# EAGLE design MySens-GWeasySensRS485-V01-045 (EAGLE 7.6.0)
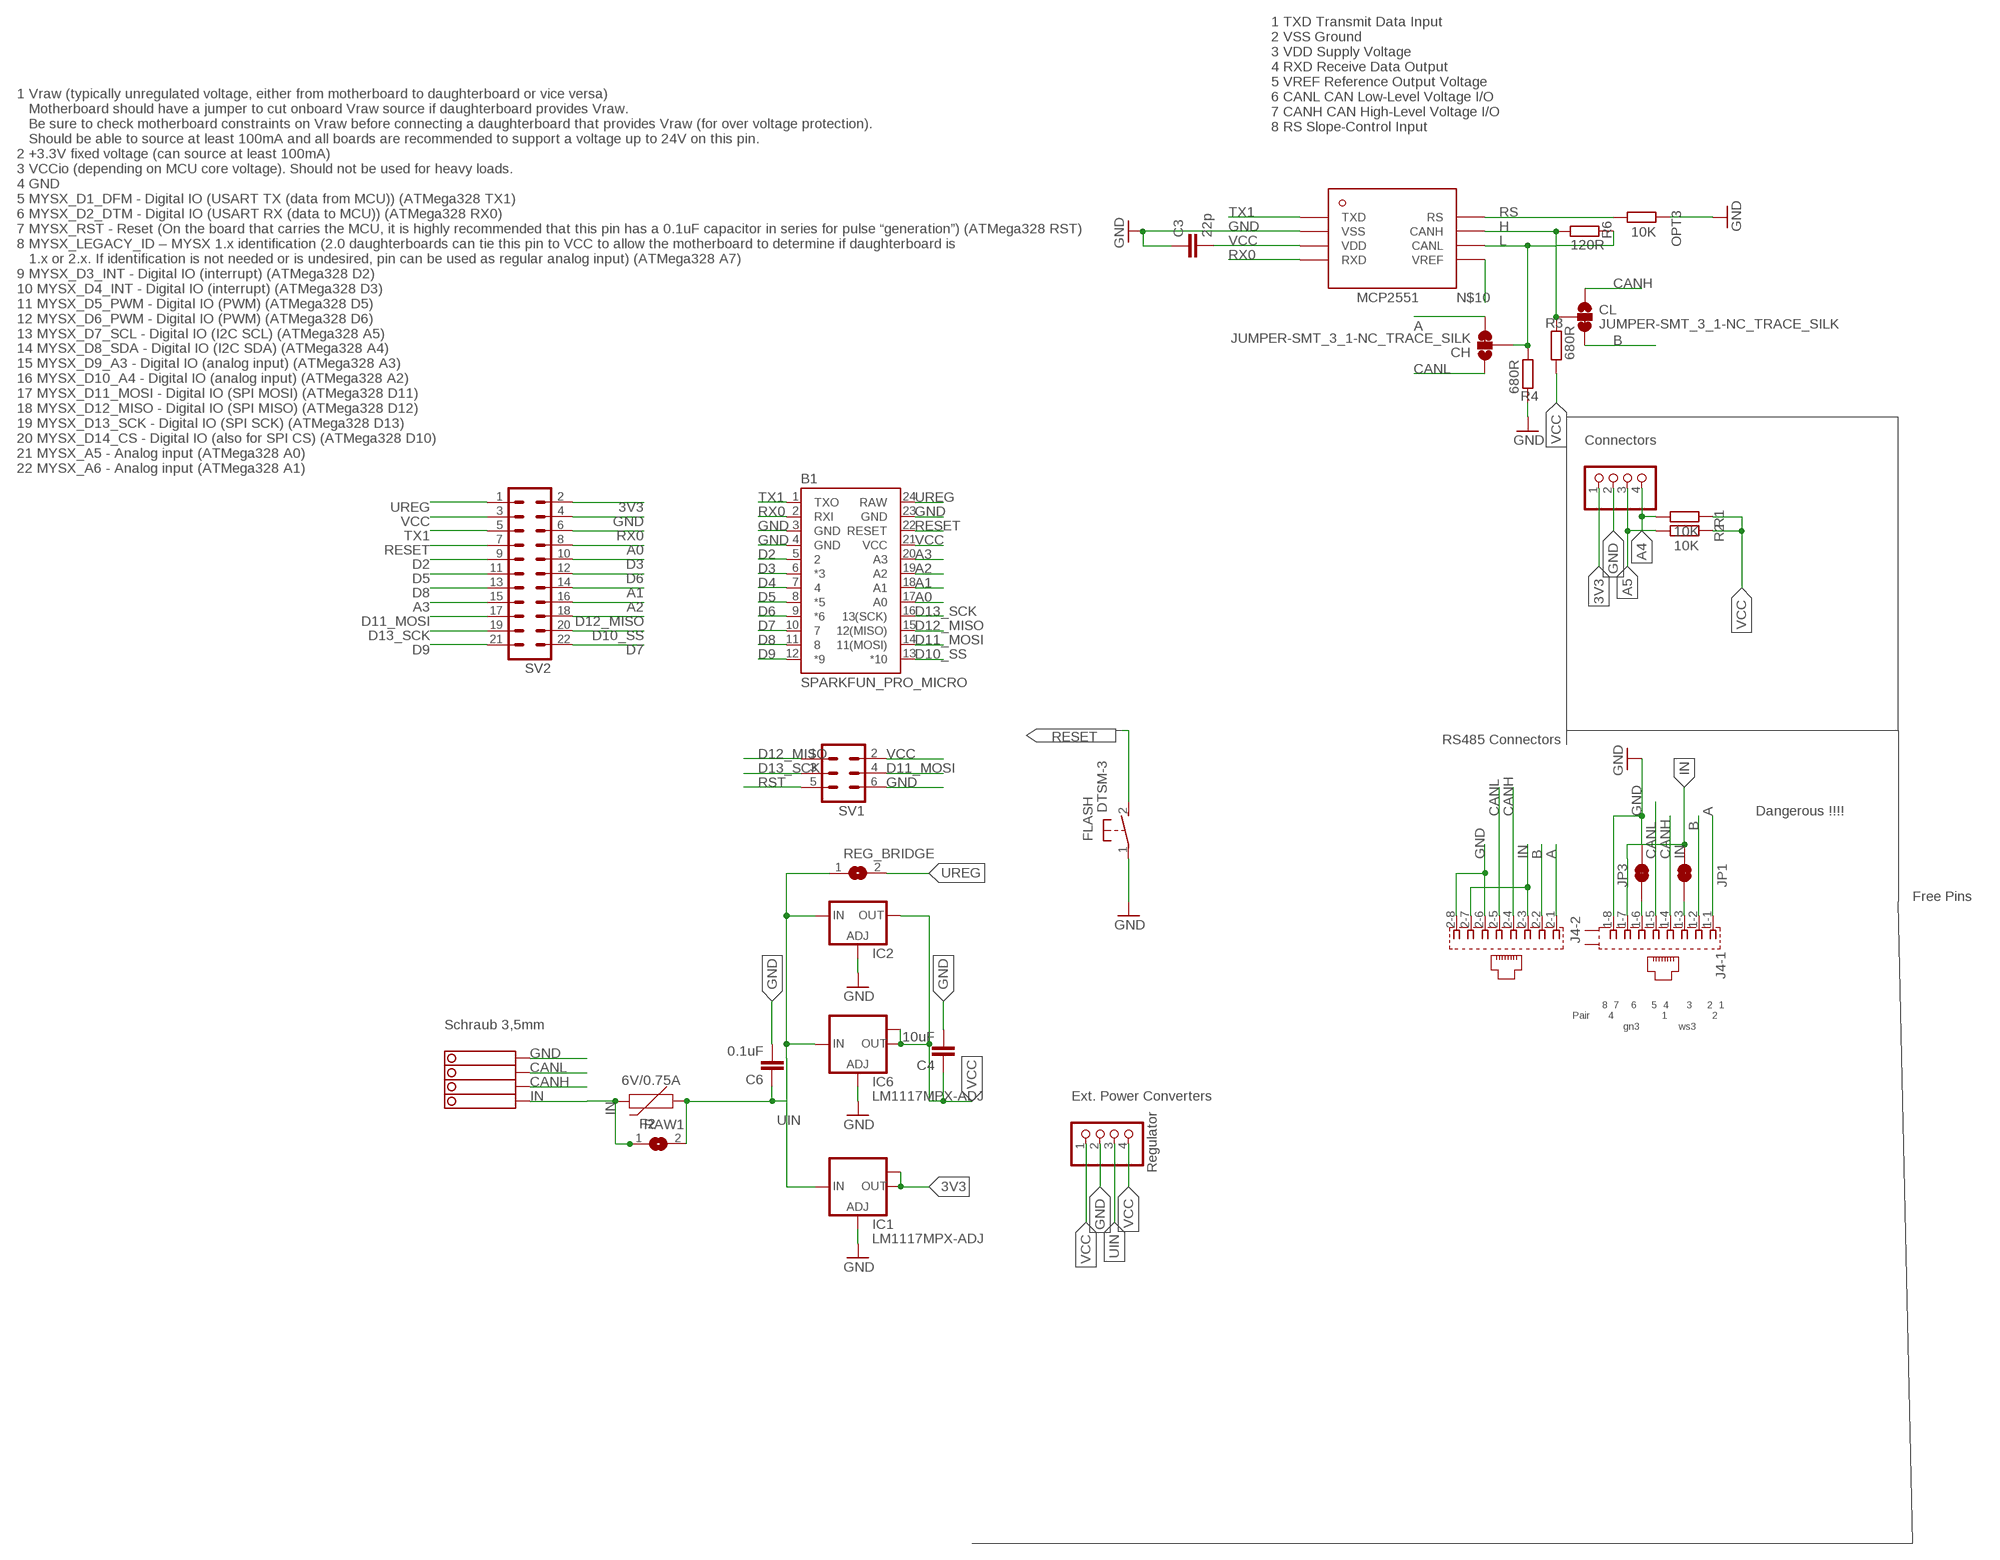
[diagram p0: schematic, sheet 1]

## Parts
B1  SPARKFUN_PRO_MICRO  [SPARKFUN_PRO_MICRO]
C3  22p  C-EUC0805  [C0805]
C4  10uF  C-EUC1210  [C1210]
C6  0.1uF  C-EUC1206  [C1206]
CH  JUMPER-SMT_3_1-NC_TRACE_SILK  [SMT-JUMPER_3_1-NC_TRACE_SILK]
CL  JUMPER-SMT_3_1-NC_TRACE_SILK  [SMT-JUMPER_3_1-NC_TRACE_SILK]
F2  6V/0.75A  PPTC_THREE-QUARTER-AMP  [1206]
FLASH  DTSM-3  [DTSM-3]
I2C  PINHD-1X04_2.54-S  [1X04-S]
IC1  LM1117MPX-ADJ  [SOT223]
IC2  LD117ADT50TR  [DPACK]
IC6  LM1117MPX-ADJ  [SOT223]
J4  RJ45_2X_NARROW_SHILDPINS_NOCASE  [RJ45_2X_NARROW_SHILDPINS_NOCASE]
JP1  JUMPER-SMT_2_NC_TRACE_SILK  [SMT-JUMPER_2_NC_TRACE_SILK]
JP3  JUMPER-SMT_2_NC_TRACE_SILK  [SMT-JUMPER_2_NC_TRACE_SILK]
OPT3  10K  R-EU_R0805  [R0805]
R1  10K  R-EU_R0805  [R0805]
R2  10K  R-EU_R0805  [R0805]
R3  680R  R-EU_R0805  [R0805]
R4  680R  R-EU_R0805  [R0805]
R6  120R  R-EU_R0805  [R0805]
RAW1  SJ  [SJ]
REG_BRIDGE  SJ  [SJ]
STEPDWN  PINHD-1X04_2.54-S  [1X04-S]
SV1  MA03-2  [MA03-2]
SV2  MA11-2  [MA11-2]
U$1  MCP2551  [SOIC-8]
X4  1751264  [1751264]

## Nets
1: J4.1-3 JP1.1
2: J4.1-6 JP3.1
3V3: I2C.1 IC1.2(OUT) IC1.TAB(OUT1) SV2.2
A: CH.3 J4.1-1 J4.2-1
A0: B1.17(A0) SV2.8
A1: B1.18(A1) SV2.14
A2: B1.19(A2) SV2.16
A3: B1.20(A3) SV2.15
A4: I2C.4 R1.2
A5: I2C.3 R2.2
B: CL.3 J4.1-2 J4.2-2
CANH: CL.1 J4.1-4 J4.2-4 X4.2
CANL: CH.1 J4.1-5 J4.2-5 X4.3
D2: B1.5 SV2.9
D3: B1.6(*3) SV2.10
D4: B1.7
D5: B1.8(*5) SV2.11
D6: B1.9(*6) SV2.12
D7: B1.10 SV2.22
D8: B1.11 SV2.13
D9: B1.12(*9) SV2.21
D10_SS: B1.13(*10) SV2.20
D11_MOSI: B1.14(11(MOSI)) SV1.4 SV2.17
D12_MISO: B1.15(12(MISO)) SV1.1 SV2.18
D13_SCK: B1.16(13(SCK)) SV1.3 SV2.19
GND [Power]: B1.3(GND) B1.4(GND) B1.23(GND) C3.1 C4.2 C6.2 FLASH.1 I2C.2 IC1.1(ADJ) IC2.1(ADJ) IC6.1(ADJ) J4.1-8 J4.2-6 J4.2-8 JP3.2 OPT3.1 R4.2 STEPDWN.2 SV1.6 SV2.4 U$1.VSS X4.4
H: CL.2 R3.2 R6.1 U$1.CANH
IN [Power]: F2.2 J4.1-7 J4.2-3 J4.2-7 JP1.2 RAW1.1 X4.1
L: CH.2 R4.1 R6.2 U$1.CANL
N$10: U$1.VREF
RESET: B1.22(RESET) FLASH.2 SV2.7
RS: OPT3.2 U$1.RS
RST: SV1.5
RX0: B1.2(RXI) SV2.6 U$1.RXD
TX1: B1.1(TXO) SV2.5 U$1.TXD
UIN [Power]: C6.1 F2.1 IC1.3(IN) IC2.3(IN) IC6.3(IN) RAW1.2 REG_BRIDGE.1 STEPDWN.3
UREG [Power]: B1.24(RAW) REG_BRIDGE.2 SV2.1
VCC [Power]: B1.21(VCC) C3.2 C4.1 IC2.4(OUT) IC6.2(OUT) IC6.TAB(OUT1) R1.1 R2.1 R3.1 STEPDWN.1 STEPDWN.4 SV1.2 SV2.3 U$1.VDD
Unconnected: J4.G1(-1:S1) J4.G3(-1:S2)

## Notes on the sheet
- 1 TXD Transmit Data Input 
  2 VSS Ground 
  3 VDD Supply Voltage 
  4 RXD Receive Data Output 
  5 VREF Reference Output Voltage 
  6 CANL CAN Low-Level Voltage I/O 
  7 CANH CAN High-Level Voltage I/O 
  8 RS Slope-Control Input
- Connectors
- 1 Vraw (typically unregulated voltage, either from motherboard to daughterboard or vice versa)
     Motherboard should have a jumper to cut onboard Vraw source if daughterboard provides Vraw. 
     Be sure to check motherboard constraints on Vraw before connecting a daughterboard that provides Vraw (for over voltage protection). 
     Should be able to source at least 100mA and all boards are recommended to support a voltage up to 24V on this pin.
  2 +3.3V fixed voltage (can source at least 100mA)
  3 VCCio (depending on MCU core voltage). Should not be used for heavy loads.
  4 GND
  5 MYSX_D1_DFM - Digital IO (USART TX (data from MCU)) (ATMega328 TX1)
  6 MYSX_D2_DTM - Digital IO (USART RX (data to MCU)) (ATMega328 RX0)
  7 MYSX_RST - Reset (On the board that carries the MCU, it is highly recommended that this pin has a 0.1uF capacitor in series for pulse “generation”) (ATMega328 RST)
  8 MYSX_LEGACY_ID – MYSX 1.x identification (2.0 daughterboards can tie this pin to VCC to allow the motherboard to determine if daughterboard is 
     1.x or 2.x. If identification is not needed or is undesired, pin can be used as regular analog input) (ATMega328 A7)
  9 MYSX_D3_INT - Digital IO (interrupt) (ATMega328 D2)
  10 MYSX_D4_INT - Digital IO (interrupt) (ATMega328 D3)
  11 MYSX_D5_PWM - Digital IO (PWM) (ATMega328 D5)
  12 MYSX_D6_PWM - Digital IO (PWM) (ATMega328 D6)
  13 MYSX_D7_SCL - Digital IO (I2C SCL) (ATMega328 A5)
  14 MYSX_D8_SDA - Digital IO (I2C SDA) (ATMega328 A4)
  15 MYSX_D9_A3 - Digital IO (analog input) (ATMega328 A3)
  16 MYSX_D10_A4 - Digital IO (analog input) (ATMega328 A2)
  17 MYSX_D11_MOSI - Digital IO (SPI MOSI) (ATMega328 D11)
  18 MYSX_D12_MISO - Digital IO (SPI MISO) (ATMega328 D12)
  19 MYSX_D13_SCK - Digital IO (SPI SCK) (ATMega328 D13)
  20 MYSX_D14_CS - Digital IO (also for SPI CS) (ATMega328 D10)
  21 MYSX_A5 - Analog input (ATMega328 A0)
  22 MYSX_A6 - Analog input (ATMega328 A1)
- RS485 Connectors
- Dangerous !!!!
- Free Pins
- Schraub 3,5mm
- 8  7    6     5  4      3     2  1
  Pair      4                1               2
                   gn3             ws3
- Ext. Power Converters
- Regulator

## Library data of the parts
B1 = SparkFun-Boards:SPARKFUN_PRO_MICRO: SparkFun Pro Micro Atmega32U4 compatible footprint. SparkFun Products: 3.3V/8MHz <https://www.sparkfun.com/products/12587> 5V/16MHz <https://www.sparkfun.com/products/12640>
C3 C4 C6 = rcl:C-EU: CAPACITOR, European symbol
CH CL = SparkFun-Jumpers:JUMPER-SMT_3_1-NC_TRACE: Normally closed trace jumper (1 of 2 connections) This jumper has a trace between two pads so it's normally closed (NC). The other connection is normally open (NO). Use a razor knife to open the connection. For best results follow the IPC guidelines for cutting traces: Cutout at least 0.063 mm (0.005 in). Remove all loose material to clean up the cut area. Seal the cut with an approved epoxy. Reapply solder to reclose the connection, or to close the NO connection.
F2 = SparkFun-Fuses:PPTC: Resettable Fuse PPTC Resettable Fuse. Really a sort of resistor with a polymeric positive temperature coefficient whose resistance increases dramatically with an increase in temperature. When heated by the power passing through the resistance rises causing the current to be limited, protecting the circuit. This is achieved by the transition of the polymer from a crystalline to an amorphous state where the conductive carbon separates breaking the conductive pathways found in the cool crystalline structure. When a PPTC cools back down it resumes conducting letting the circuit turn back on. SparkFun Products: SparkFun RedBoard - Programmed with Arduino <https://www.sparkfun.com/products/12757> Pro Micro - 5V/16MHz <https://www.sparkfun.com/products/12640> Arduino Pro 328 - 5V/16MHz <https://www.sparkfun.com/products/10915> MP3 Trigger <https://www.sparkfun.com/products/13720>; PROD_ID: RES-11150
FLASH = mechanics:DTSM-3: Diptronics SMD button 6x3.5 mm
I2C STEPDWN = pinhead-2:PINHD-1X04: PIN HEADER
IC1 IC6 = lm1117:LM1117MPX-ADJ
IC2 = v-reg:LD117A?*: Low drop fixed and adjustable positive voltage regulators 1 A Source: http://www.st.com/stonline/products/literature/ds/7194/ld1117axx.pdf
J4 = RJ45:RJ45_2X_NARROW_SHILDPINS_NOCASE: RJ45 connector
JP1 JP3 = SparkFun-Jumpers:JUMPER-SMT_2_NC_TRACE: Normally closed trace jumper This jumper has a trace between two pads so it's normally closed (NC). Use a razor knife to open the connection. For best results follow the IPC guidelines for cutting traces: Cutout at least 0.063 mm (0.005 in). Remove all loose material to clean up the cut area. Seal the cut with an approved epoxy. Reapply solder to reclose the connection.
OPT3 R1-R4 R6 = rcl:R-EU_: RESISTOR, European symbol
RAW1 REG_BRIDGE = jumper:SJ: SMD solder JUMPER
SV1 = con-lstb:MA03-2: PIN HEADER; OC_FARNELL: unknown; OC_NEWARK: unknown
SV2 = con-Pinheader:MA11-2: PIN HEADER; OC_FARNELL: unknown; OC_NEWARK: unknown
U$1 = MCP2551:MCP2551: The MCP2551 is a high-speed CAN, fault-tolerant device that serves as the interface between a CAN protocol controller and the physical bus. The MCP2551 provides differential transmit and receive capability for the CAN protocol controller and is fully compatible with the ISO-11898 standard, including 24V requirements. It will operate at speeds of up to 1 Mb/s. Typically, each node in a CAN system must have a device to convert the digital signals generated by a CAN controller to signals suitable for transmission over the bus cabling (differential output). It also provides a buffer between the CAN controller and the high-voltage spikes that can be generated on the CAN bus by outside sources (EMI, ESD, electrical transients, etc.).
X4 = con-phoenix-350:1751264: MKDS 1/ 4-3,5 Printklemme Nennstrom: 10 A Bemessungsspannung: 160 V Raster: 3,5 mm Polzahl: 4 Montageart: Löten Anschlussart: Schraubanschluss Anschlussrichtung vom Leiter zur Platine: 0° Source: http://eshop.phoenixcontact.com .. 1751264.pdf; MPN: 1751264; OC_FARNELL: unknown; OC_NEWARK: 10R0934

## Net classes
0 default: width 0.254 mm
1 Power: width 0.508 mm

## Board
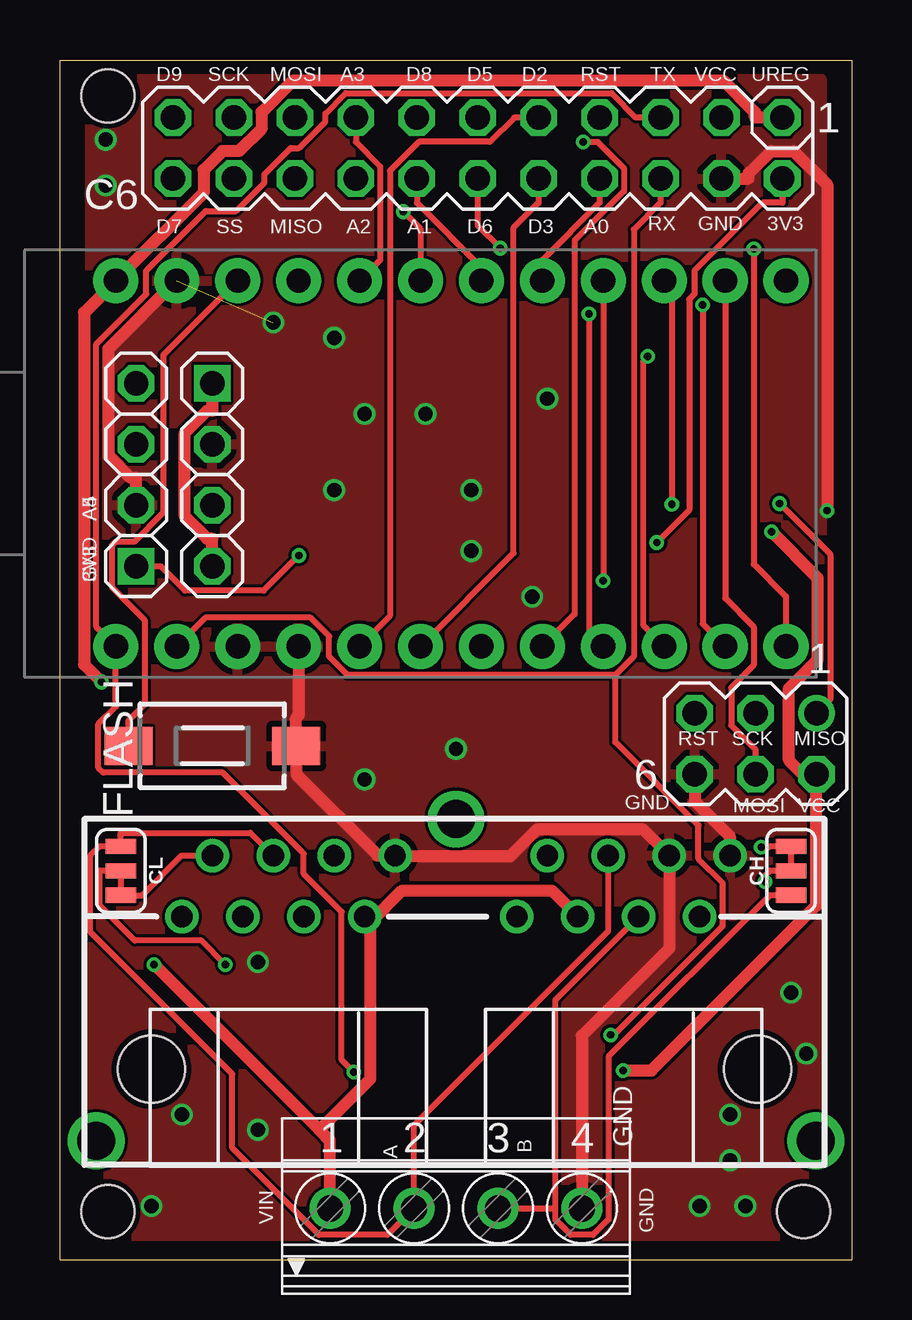
[diagram p1: board, top side]
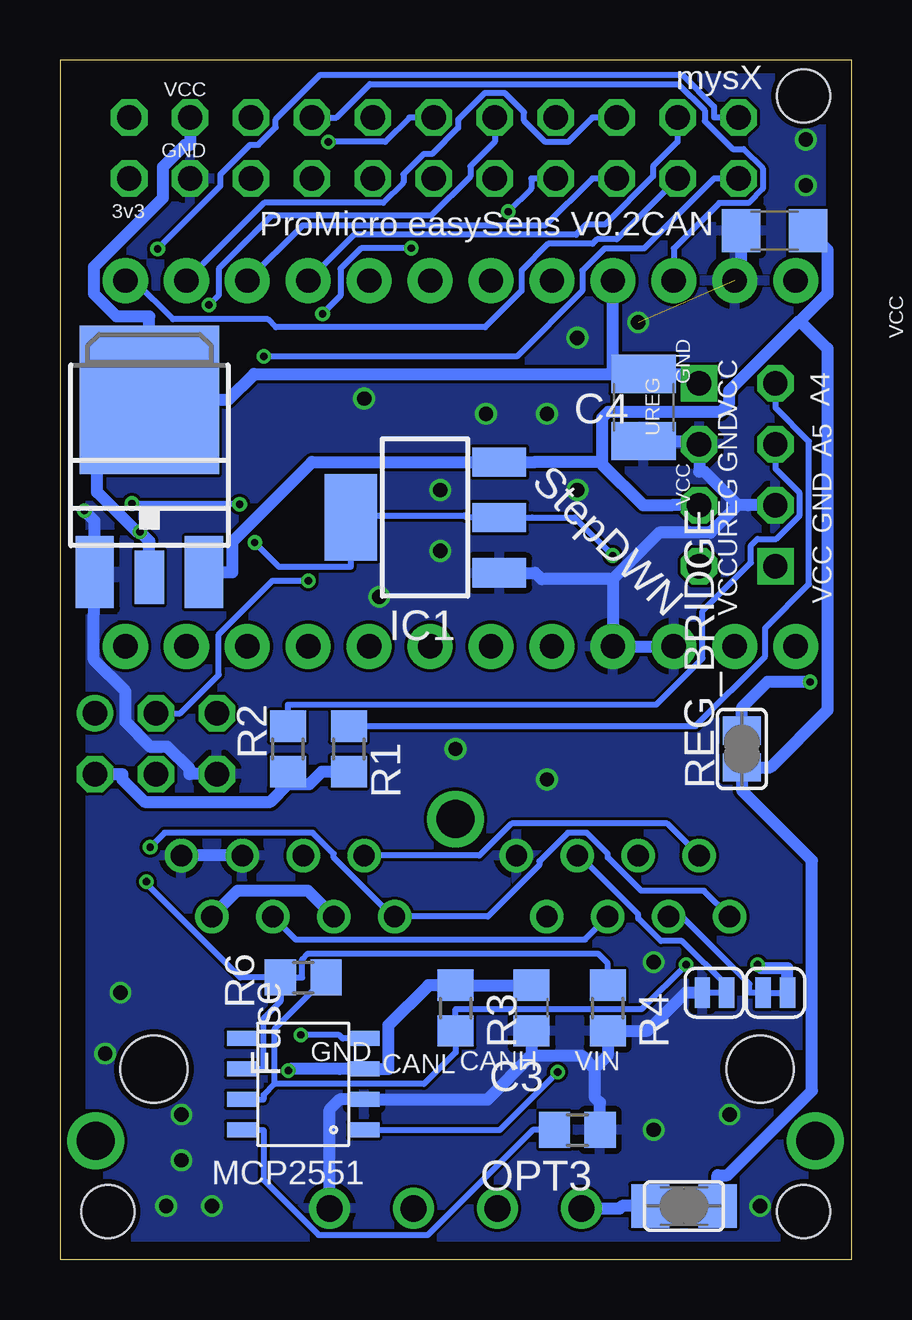
[diagram p2: board, bottom side, seen from below]

Size 33 x 50 mm. Coordinates in mm from the lower left corner, seen from the top.
Outline: 0,0 0,50 33,50 33,0 0,0
Copper layers (1*16): Top 0.035mm / dielectric 1.5mm / Bottom 0.035mm
Design rules "dirt_cheap_dirty_boards.v1": minimum track width 5mil, minimum drill 12mil, track to track 5mil, track to pad 5mil, pad to pad 5mil, via to via 5mil, smd to smd 0mil, copper to edge 10mil, drill to drill 10mil, minimum pad ring 10mil, minimum via ring 6mil, stop-mask expansion 2mil, vias tented up to drill 25mil, thermal gap 10mil
Holes 2.2 mm at 2,48.5 31,2 2,2
tRestrict: area 0,50 to 33,50.5; area 32.8,11.9 to 33.3,44.9; area 0,10.5 to 0.6,43.5
bRestrict: area 0,50 to 33,50.5; area 32.8,12 to 33.3,45

### Footprints (pad centres in the part's own frame; a part is rotated, then mirrored left to right if it is on the bottom)
SPARKFUN_PRO_MICRO = drill 1.016 pad 1.88: 1 -7.62,12.7; 2 -7.62,10.16; 3 -7.62,7.62; 4 -7.62,5.08; 5 -7.62,2.54; 6 -7.62,0; 7 -7.62,-2.54; 8 -7.62,-5.08; 9 -7.62,-7.62; 10 -7.62,-10.16; 11 -7.62,-12.7; 12 -7.62,-15.24; 13 7.62,-15.24; 14 7.62,-12.7; 15 7.62,-10.16; 16 7.62,-7.62; 17 7.62,-5.08; 18 7.62,-2.54; 19 7.62,0; 20 7.62,2.54; 21 7.62,5.08; 22 7.62,7.62; 23 7.62,10.16; 24 7.62,12.7
C0805 = smd 1.3 x 1.5: 1 -0.95,0; 2 0.95,0
C1210 = smd 1.6 x 2.7: 1 -1.4,0; 2 1.4,0
C1206 = smd 1.6 x 1.8: 1 -1.4,0; 2 1.4,0
SMT-JUMPER_3_1-NC_TRACE_SILK = smd 0.635 x 1.27: 1 -1.016,0; 2 0,0; 3 1.016,0
1206 = smd 1.6 x 1.8: 1 -1.4,0; 2 1.4,0
DTSM-3 = smd 2 x 1.6: 1 -3.494,0; 2 3.494,0
1X04-S = drill 1.016 square: 1 -3.81,0 | drill 1.016 octagon: 2 -1.27,0; 3 1.27,0; 4 3.81,0
SOT223 = smd 1.219 x 2.235: 1 -2.311,-3.099; 2 0,-3.099; 3 2.311,-3.099 | smd 3.6 x 2.2: TAB 0,3.099
DPACK = smd 1.6 x 3: 1 -2.28,-4.8; 3 2.28,-4.8 | smd 5.8 x 6.2: 4 0,2.38
RJ45_2X_NARROW_SHILDPINS_NOCASE = drill 0.889: 1-1 -11.43,6.35; 1-2 -10.16,8.89; 1-3 -8.89,6.35; 1-4 -7.62,8.89; 1-5 -6.35,6.35; 1-6 -5.08,8.89; 1-7 -3.81,6.35; 1-8 -2.54,8.89; 2-1 2.54,6.35; 2-2 3.81,8.89; 2-3 5.08,6.35; 2-4 6.35,8.89; 2-5 7.62,6.35; 2-6 8.89,8.89; 2-7 10.16,6.35; 2-8 11.43,8.89 | drill 1.575 pad 2.184: G1 -15,-3; G2 0,10.414; G3 15,-3 | hole 2.8: -12.7,0; 12.573,0
SMT-JUMPER_2_NC_TRACE_SILK = smd 0.635 x 1.27: 1 -0.508,0; 2 0.508,0
R0805 = smd 1.3 x 1.5: 1 -0.95,0; 2 0.95,0
SJ = smd 1.168 x 1.6: 1 -0.762,0; 2 0.762,0
MA03-2 = drill 1.016: 1 -2.54,-1.27 | drill 1.016 octagon: 2 -2.54,1.27; 3 0,-1.27; 4 0,1.27; 5 2.54,-1.27; 6 2.54,1.27
MA11-2 = drill 1.016 octagon: 1 -12.7,-1.27; 2 -12.7,1.27; 3 -10.16,-1.27; 4 -10.16,1.27; 5 -7.62,-1.27; 6 -7.62,1.27; 7 -5.08,-1.27; 8 -5.08,1.27; 9 -2.54,-1.27; 10 -2.54,1.27; 11 0,-1.27; 12 0,1.27; 13 2.54,-1.27; 14 2.54,1.27; 15 5.08,-1.27; 16 5.08,1.27; 17 7.62,-1.27; 18 7.62,1.27; 19 10.16,-1.27; 20 10.16,1.27; 21 12.7,-1.27; 22 12.7,1.27
SOIC-8 = smd 1.27 x 0.635: CANH 2.54,0.635; CANL 2.54,-0.635; RS 2.54,1.905; RXD -2.54,-1.905; TXD -2.54,1.905; VDD -2.54,-0.635; VREF 2.54,-1.905; VSS -2.54,0.635
1751264 = drill 1.1 pad 1.7: 1 -5.25,-0.1; 2 -1.75,-0.1; 3 1.75,-0.1; 4 5.25,-0.1

### Placement (x,y rotation side)
B1  15.03,33.18 90 top
C3  13.34,10.48 90 bottom
C4  8.67,35.52 270 bottom
C6  3.21,42.89 180 bottom
CH  30.48,16.2 90 top
CL  2.54,16.2 270 top
F2  6.99,2.23 180 bottom
FLASH  6.35,21.41 180 top
I2C  3.17,32.71 90 top
IC1  17.78,30.93 90 bottom
IC2  29.27,33.46 0 bottom
IC6  29.27,31.54 0 bottom
J4  16.51,7.95 0 top
JP1  3.17,11.12 0 bottom
JP3  5.71,11.12 180 bottom
OPT3  11.43,5.41 180 bottom
R1  20.95,21.28 90 bottom
R2  23.5,21.28 90 bottom
R3  16.51,10.48 270 bottom
R4  10.16,10.48 270 bottom
R6  22.86,11.76 180 bottom
RAW1  6.99,2.23 0 bottom
REG_BRIDGE  4.57,21.28 90 bottom
STEPDWN  6.35,32.71 270 top
SV1  29,21.5 180 top
SV2  17.41,46.33 180 top
U$1  22.86,7.31 180 bottom
X4  16.51,2.23 0 top

### Tracks (layer width: path | path; a pad name or v marks a point on that pad's centre or on a via)
1
  Bottom 0.254: JP1.1 4.25,11.12 4.25,11.49 7.06,14.29 J4.1-3
2
  Bottom 0.254: JP3.1 5.21,11.42 7.06,13.27 7.95,13.27 8.89,14.22 8.89,14.38 11.35,16.84 J4.1-6
3V3  (via drill 0.3 pad 0.61)
  Top 0.254: v24.88,29.88 26.23,31.24 26.23,40.02 26.45,40.24 26.45,41.22 29.28,44.04 30.11,44.04 SV2.2 | v9.95,29.34 8.49,27.88 5.21,27.88 4.19,28.9 I2C.1
  Bottom 0.254: v24.88,29.88 23.88,28.88 20.88,28.88 IC1.TAB 20.88,31.02 16.14,31.02 16.05,30.93 IC1.2 13.31,30.93 11.54,30.93 v9.95,29.34
A  (via drill 0.3 pad 0.61)
  Top 0.254: CH.3 29.59,17.22 29.56,17.19 v29.24,17.19
  Bottom 0.254: v29.24,17.19 28.64,17.79 22.47,17.79 21.59,16.91 21.59,16.75 19.13,14.29 J4.2-1 15.16,14.29 13.01,16.44 13.01,16.6 11.83,17.79 11.03,17.79 10.16,16.91 10.16,16.76 8.77,15.37 6.15,15.37 J4.1-1
A0
  Top 0.254: SV2.8 22.5,44.04 20.11,41.66 B1.17
A1
  Top 0.254: SV2.14 14.88,44.04 17.57,41.35 B1.18
A2  (via drill 0.3 pad 0.61)
  Top 0.254: v14.32,43.68 15.03,42.96 B1.19
  Bottom 0.254: SV2.16 13.35,45.06 13.35,44.64 v14.32,43.68
A3
  Top 0.254: SV2.15 12.34,46.58 13.35,45.57 13.35,41.66 B1.20
A4
  Bottom 0.254: I2C.4 3.17,35.5 1.77,34.1 1.77,28.15 3.6,26.32 3.6,25.14 6.51,22.23 R1.2
A5
  Bottom 0.254: I2C.3 3.17,32.96 2.16,31.95 2.16,31.02 3.14,30.04 3.92,30.04 4.19,29.77 4.19,29.05 6.22,27.03 6.22,25.06 8.14,23.13 23.5,23.13 R2.2
B
  Top 0.254: J4.1-2 5.08,16.84 3.43,15.18 CL.3
  Bottom 0.254: J4.1-2 7.69,18.17 14.18,18.17 15.51,16.84 J4.2-2
CANH
  Top 0.254: J4.2-4 22.86,13.7 14.76,5.6 X4.2 13.66,1.03 10.8,1.03 7.18,4.65 7.18,7.74 1.27,13.65 1.27,16.83 1.65,17.22 CL.1 2.54,17.79 7.94,17.79 J4.1-4
CANL
  Top 0.254: 20.65,2.13 20.65,10.82 J4.2-5 | 20.65,2.13 20.65,1.67 21.3,1.02 22.22,1.02 22.87,1.67 22.87,8.46 29.59,15.18 CH.1 | X4.3 20.65,2.13
  Bottom 0.254: J4.2-5 23.18,13.34 11.11,13.34 J4.1-5
D2
  Top 0.254: B1.5 13.76,26.83 13.76,45.38 14.96,46.58 17.92,46.58 18.94,47.6 SV2.9
D3
  Top 0.254: B1.6 18.92,29.45 18.92,43.01 19.95,44.04 SV2.10
D5  (via drill 0.3 pad 0.61)
  Top 0.254: v21.82,46.58 22.41,46.58 23.51,45.49 23.51,44.52 21.46,42.47 21.46,26.91 B1.8
  Bottom 0.254: v21.82,46.58 19.45,46.58 18.43,47.6 SV2.11
D6  (via drill 0.3 pad 0.61)
  Top 0.254: v22.05,39.42 22.05,26.16 B1.9 | SV2.12 17.41,43.1 v18.36,42.16
  Bottom 0.254: v18.36,42.16 20.45,42.16 21.3,41.3 21.3,40.17 v22.05,39.42
D7  (via drill 0.3 pad 0.61)
  Top 0.254: B1.10 24.32,26.43 24.32,37.46 v24.5,37.64
  Bottom 0.254: v24.5,37.64 13.95,37.64 11.22,40.38 11.22,41.22 10.3,42.14 8.65,42.14 5.73,45.06 SV2.22
D8  (via drill 0.3 pad 0.61)
  Top 0.254: v26.79,39.79 26.79,26.5 B1.11
  Bottom 0.254: v26.79,39.79 26.38,40.2 26.38,41.3 24.18,43.51 17.53,43.51 15.89,45.14 15.89,45.57 14.88,46.58 SV2.13
D9  (via drill 0.3 pad 0.61)
  Top 0.254: v28.93,42.13 28.93,28.98 30.27,27.64 B1.12
  Bottom 0.254: v28.93,42.13 26.3,44.75 26.3,45.23 25.08,46.46 24.74,46.46 24.01,47.19 24.01,47.52 22.15,49.38 7.06,49.38 5.73,48.05 5.73,47.6 SV2.21
D10_SS
  Bottom 0.254: SV2.20 9.79,42.53 10.61,42.53 10.8,42.34 12.65,42.34 13.76,41.22 13.76,40.38 15.28,38.86 24,38.86 24.33,39.19 28.29,39.19 29.9,40.8 B1.13
D11_MOSI
  Top 0.254: B1.14 27.73,27.57 28.93,26.37 28.93,24.78 27.98,23.84 27.98,22.26 29,21.25 SV1.4
  Bottom 0.254: SV2.17 10.81,47.6 11.83,46.58 12.75,46.58 13.65,47.48 13.65,47.81 14.45,48.62 15.3,48.62 16.4,47.52 16.4,47.17 17.5,46.08 17.84,46.08 18.68,45.23 18.68,44.89 19.53,44.04 24.49,44.04 B1.14
D12_MISO  (via drill 0.3 pad 0.61)
  Top 0.254: v30,31.51 32.11,29.41 32.11,23.34 SV1.1 | B1.15 25.51,40.48 v25.51,31.48
  Bottom 0.254: B1.15 22.89,43.1 12.77,43.1 10.81,45.06 SV2.18 | v25.51,31.48 29.97,31.48 v30,31.51
D13_SCK  (via drill 0.3 pad 0.61)
  Top 0.254: B1.16 v22.65,28.29
  Bottom 0.254: B1.16 20.73,42.72 11.49,42.72 11.07,43.14 10.28,43.14 8.27,45.15 8.27,45.57 7.25,46.58 SV2.19 | v22.65,28.29 24.15,28.29 26.38,26.05 26.38,24.37 27.98,22.77 SV1.3
GND  (via drill 0.3 pad 0.61, 0.6)  (1 unrouted)
  Top 0.508: SV1.6 26.46,19.09 27.94,17.61 J4.2-8 | X4.4 21.76,9.32 25.4,12.96 J4.2-6 24.32,17.92 19.88,17.92 18.75,16.79 14.01,16.79 J4.1-8 13.23,16.84 9.84,20.23 FLASH.1 9.84,22.59 9.95,22.69 B1.4 | SV2.4 28.72,45.06 28.72,45.28 29.64,46.21 30.59,46.21 31.98,44.81 v31.98,31.21 | I2C.2 3.17,32.58 2.95,32.58 2.03,33.51 2.03,37.96 B1.23
  Bottom 0.508: 10.71,7.95 10.16,8.5 R4.2 8.51,9.54 6.92,11.12 JP3.2 | 13.34,8.5 11.26,8.5 10.71,7.95 | 10.71,7.95 10.71,6.77 10.48,6.54 OPT3.1 | v31.98,31.21 31.55,30.79 IC2.1 31.55,28.47 IC6.1 31.58,26.94 31.59,26.93 31.59,24.99 30.27,23.67 30.27,22.42 29.23,21.37 28.52,21.37 27.6,20.45 27.6,20.23 SV1.6 | J4.2-6 J4.2-8 | IC1.1 13.18,28.62 12.92,28.36 9.95,28.36 | 4.73,31.44 5.88,30.3 8.01,30.3 9.95,28.36 | 9.95,28.36 B1.4 B1.3 | 4.73,31.44 6.13,32.84 6.35,32.84 STEPDWN.2 6.8,33.98 6.94,34.11 C4.2 | 4.73,31.44 4.32,31.44 I2C.2 | 13.34,8.5 15.16,6.67 U$1.VSS 21.34,6.67 21.76,6.25 X4.4 | C6.2 4.61,41.6 4.87,41.34 B1.23 | C3.1 13.34,8.5
  other vias: 8.89,39.06 15.24,35.25 12.7,20.01 16.51,21.28 5.08,6.04 3.81,2.23 26.67,2.23 30.48,11.12 27.94,6.04 28.57,2.23 12.7,35.25 11.43,38.42 11.43,32.08 17.14,29.54 17.14,32.08 20.32,35.88 19.68,27.63 1.91,46.68 1.91,44.77 31.11,8.58 27.94,4.13 8.26,5.41 8.26,12.39
  pour Top: 1.27,49.22 31.75,49.22 31.75,0.96 1.27,0.96
  pour Bottom: 1.27,49.22 31.75,49.22 31.75,0.96 1.27,0.96
H  (via drill 0.3 pad 0.61)
  Top 0.254: v6.89,12.29 5.89,13.29 3.12,13.29 1.65,14.76 1.65,16.2 CL.2
  Bottom 0.254: 24.04,7.31 24.51,6.85 24.51,6.67 U$1.CANH | 24.04,7.31 17.83,7.31 16.51,8.63 R3.2 16.51,10.44 8.74,10.44 v6.89,12.29 | 24.04,7.31 24.04,9.62 R6.1
IN  (via drill 0.3 pad 0.61)
  Top 0.508: 10.82,5.4 v3.92,12.29 | X4.1 11.26,4.95 10.82,5.4 | 10.82,5.4 12.94,7.52 12.94,14.05 | 12.94,14.05 J4.1-7 | 12.94,14.05 14.27,15.38 20.51,15.38 J4.2-3
  Bottom 0.508: JP1.2 2.67,12.14 3.76,12.14 v3.92,12.29 | X4.1 9.67,2.13 9.57,2.23 F2.2 RAW1.1 | J4.2-7 25.58,15.38 22.68,15.38 J4.2-3
L  (via drill 0.3 pad 0.61)
  Top 0.254: v29.39,15.75 29.39,16 29.59,16.2 CH.2
  Bottom 0.254: R6.2 22.91,11.76 22.91,12.52 22.67,12.76 10.58,12.76 10.16,12.34 R4.1 | R6.2 25.49,11.76 29.39,15.66 v29.39,15.75 | R6.2 23.81,10.75 24.51,10.05 24.51,7.95 U$1.CANL
RESET
  Top 0.254: FLASH.2 2.86,22.46 3.52,23.13 3.52,26.67 2.16,28.03 2.16,29.77 2.31,29.92 3.09,29.92 4.31,31.14 4.31,37.7 B1.22
  Bottom 0.254: B1.22 7.41,42.14 5.51,44.04 4.29,44.04 3.7,44.63 3.7,45.48 4.5,46.29 4.96,46.29 6.12,47.45 6.12,47.9 7.22,49 20.08,49 21.48,47.6 SV2.7
RS
  Bottom 0.254: OPT3.2 13.28,5.41 17.67,1.02 22.22,1.02 24.51,3.31 24.51,5.41 U$1.RS
RX0  (via drill 0.3 pad 0.61)
  Top 0.254: v22.96,9.36 23.09,9.36 27.63,13.9 27.63,15.69 26.62,16.7 26.62,18.1 23.15,21.57 23.15,24.37 | 23.15,24.37 11.99,24.37 11.22,25.13 11.22,25.98 10.45,26.75 6.07,26.75 B1.2 | 23.15,24.37 23.92,25.14 23.92,42.93 25.04,44.04 SV2.6
  Bottom 0.254: U$1.RXD 21.21,9.21 21.36,9.36 v22.96,9.36
TX1  (via drill 0.3 pad 0.61)
  Top 0.254: v12.26,7.81 11.75,8.32 11.75,14.49 10.16,16.08 10.16,16.92 6.78,20.3 1.8,20.3 1.6,20.5 1.6,22.31 2.33,23.04 B1.1 1.52,26.37 1.52,38.17 3.6,40.25 3.6,41.22 6.08,43.7 7.34,43.7 8.53,44.9 8.53,45.24 9.62,46.33 9.96,46.33 11.06,47.43 11.06,47.77 11.91,48.62 23,48.62 24.02,47.6 SV2.5
  Bottom 0.254: U$1.TXD 14.66,5.41 v12.26,7.81
UIN
  Bottom 0.508: IC6.3 26.99,28.47 IC2.3 25.81,28.66 25.81,29.92 22.49,33.24 IC1.3 13.18,33.24 10.4,33.24 | 10.4,33.24 10.4,33.16 8.68,31.44 7.49,31.44 STEPDWN.3 | 2.15,39.11 2.2,39.11 5.11,36.2 5.11,35.69 5.48,35.33 10.15,35.33 10.4,35.07 10.4,33.24 | 2.15,39.11 1.01,37.97 1.01,22.9 3.39,20.52 REG_BRIDGE.1 4.57,19.55 1.65,16.63 1.65,7.04 5.18,3.51 5.58,3.51 F2.1 RAW1.2 | C6.1 1.01,42.09 1.01,40.25 2.15,39.11
UREG  (via drill 0.3 pad 0.61)
  Top 0.508: v1.73,24.07 1,24.8 1,39.47 B1.24 5.99,44.45 5.99,45.41 6.78,46.2 7.48,46.2 8.4,47.12 8.4,47.83 9.7,49.12 27.67,49.12 28.97,47.82 28.97,47.6 SV2.1
  Bottom 0.508: REG_BRIDGE.2 4.57,23.01 3.5,24.07 v1.73,24.07
VCC  (via drill 0.3 pad 0.61)
  Top 0.508: v23.48,7.88 24.66,7.88 31.54,14.75 31.54,19.66 | 31.54,19.66 30.39,20.8 30.39,23.8 31.59,25 31.59,28.41 v29.67,30.34 | SV1.2 31.54,19.66 | STEPDWN.1 6.35,35.38 6.13,35.38 5.21,34.46 5.21,30.96 6.13,30.04 6.35,30.04 STEPDWN.4
  Bottom 0.508: SV1.2 30.4,20.23 30.4,20.01 29.47,19.08 24.23,19.08 23.5,19.81 | R1.1 22.09,20.33 22.6,19.81 23.5,19.81 | R2.1 23.5,19.81 | v23.48,7.88 23.41,7.95 21.34,7.95 U$1.VDD 19.3,7.95 19.3,9.77 17.64,11.43 R3.1 C3.2 | IC2.4 IC6.TAB 31.45,34.63 31.45,31.99 29.8,30.34 v29.67,30.34 29.27,29.94 29.27,29.93 IC6.2 | 9.95,36.91 C4.1 6.94,36.91 6.54,36.52 STEPDWN.1 | 9.95,36.91 24.91,36.91 25.99,35.84 IC2.4 | 9.95,36.91 B1.21 | IC2.4 29.27,39.32 30.66,39.32 31.59,40.25 31.59,41.37 28.72,44.24 28.72,45.54 27.8,46.46 27.57,46.46 SV2.3

### Text on the board
tNames: D9 | SCK | MOSI | A3 | D8 | D5 | D2 | RST | TX | VCC | UREG | C6 | D7 | SS | MISO | A2 | A1 | D6 | D3 | A0 | RX | GND | 3V3 | A4 | A5 | 3V3 | GND | RST | SCK | MISO | GND | MOSI | VCC | GND | B | A | GND | VIN
bNames: mysX | VCC | GND | 3v3 | ProMicro easySens V0.2CAN | VCC | VCC | GND | A4 | GND | A5 | UREG | GND | UREG | StepDWN | VCC | VCC | VCC | Fuse | GND | VIN | CANH | CANL